# EasyEDA Pro project iPlayer.epro

# Schematic Music player
Board Name: Music player; Create Date: 2026-07-21; Page Name: Sheet_1; Project Name: iPlayer; Schematic Name: Music player; Update Date: 2026-07-21; Add into BOM: yes; Company: Trustmebro; Convert to PCB: yes; Date: 2026-07-12; REV: 1.0; Sheet: 1/1; spicePre: .
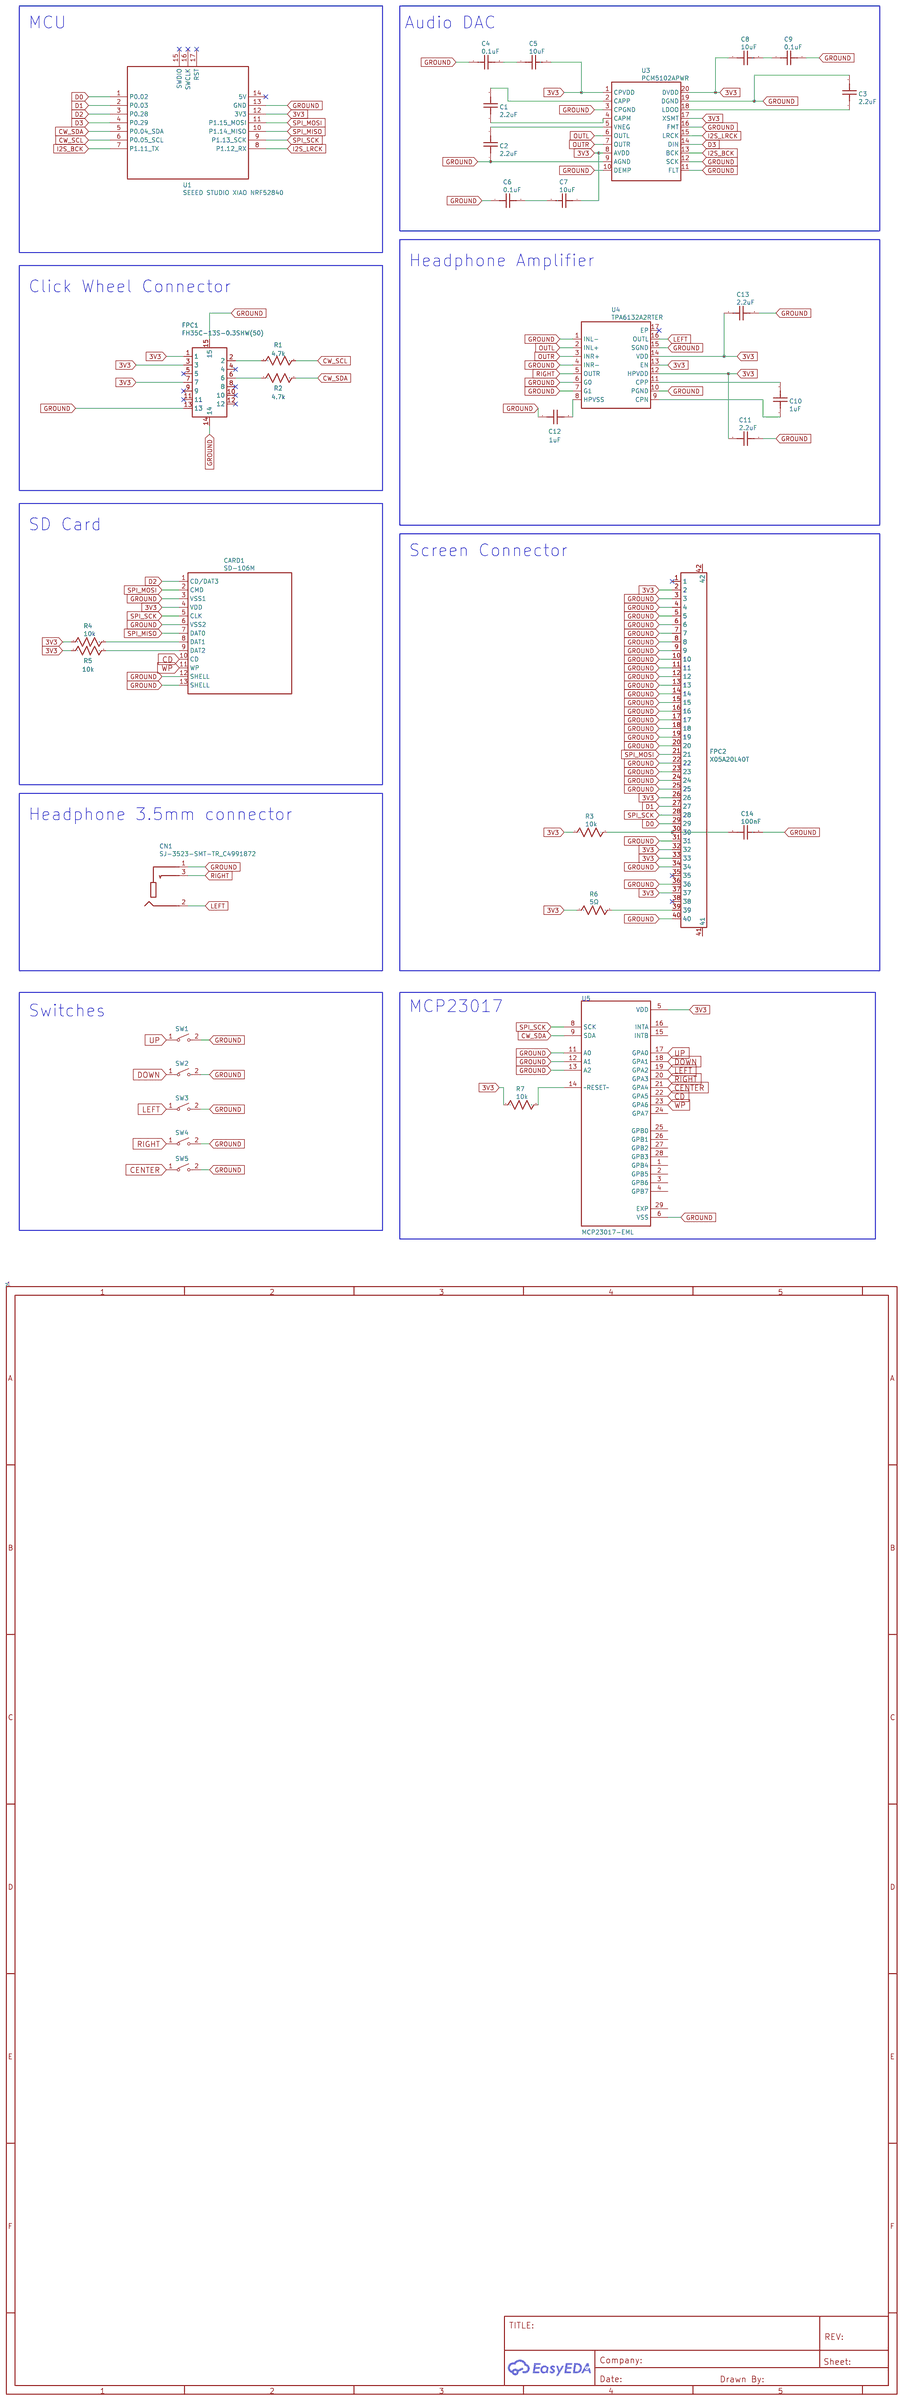
[diagram p0: schematic sheet]

## Parts
C1  2.2uF  [C0603]
C2  2.2uF  [C0603]
C3  2.2uF  [C0603]
C4  0.1uF  [C0603]
C5  10uF  [C0603]
C6  0.1uF  [C0603]
C7  10uF  [C0603]
C8  10uF  [C0603]
C9  0.1uF  [C0603]
C10  1uF  [C0603]
C11  2.2uF  [C0603]
C12  1uF  [C0603]
C13  2.2uF  [C0603]
C14  100nF  [C0603]
CARD1  SD-106M  [SD-SMD_SD-106M]
CN1  SJ-3523-SMT-TR_C4991872  [AUDIO-SMD_SJ-3523-SMT-TR]
FPC1  FH35C-13S-0.3SHW(50)  [FPC-SMD_13P-P0.60_HRS_FH35C-13S-0.3SHW]
FPC2  X05A20L40T  [FFC-SMD_40P-P0.50_X05A20L40T]
R1  4.7k  [R0603]
R2  4.7k  [R0603]
R3  10k  [R0603]
R4  10k  [R0603]
R5  10k  [R0603]
R6  5Ω  [R0603]
R7  10k  [R0603]
SW1  -  [SW-SMD_L3.9-W3.0-P4.45]
SW2  -  [SW-SMD_L3.9-W3.0-P4.45]
SW3  -  [SW-SMD_L3.9-W3.0-P4.45]
SW4  -  [SW-SMD_L3.9-W3.0-P4.45]
SW5  -  [SW-SMD_L3.9-W3.0-P4.45]
U1  SEEED STUDIO XIAO NRF52840  [SEEED STUDIO XIAO NRF52840]
U3  PCM5102APWR  [TSSOP-20_L6.5-W4.4-P0.65-LS6.4-BL]
U4  TPA6132A2RTER  [WQFN-16_L3.0-W3.0-P0.50-TL-EP1.6]
U5  MCP23017-EML  [QFN65P600X600X100-29N]

## Library data of the parts
C1-C3 C11 C13 = 2.2uF: nameAlias: Value(F); Contributor: LCEDA_Lib; spicePre: C; spiceSymbolName: C_0603_US
C4 C6 C9 = 0.1uF: nameAlias: Value(F); Contributor: LCEDA_Lib; spicePre: C; spiceSymbolName: C_0603_US
C5 C7 C8 = 10uF: nameAlias: Value(F); Contributor: LCEDA_Lib; spicePre: C; spiceSymbolName: C_0603_US
C10 C12 = 1uF: nameAlias: Value(F); Contributor: LCEDA_Lib; spicePre: C; spiceSymbolName: C_0603_US
C14 = 100nF: nameAlias: Value(F); Contributor: LCEDA_Lib; spicePre: C; spiceSymbolName: C_0603_US
CARD1 = SD-106M: Supplier: LCSC; Supplier Part: C266603; Manufacturer: XUNPU(讯普); JLCPCB Part Class: Extended Part; Contributor: LCSC; spicePre: C
CN1 = SJ-3523-SMT-TR_C4991872: Supplier: LCSC; Supplier Part: C4991872; Manufacturer: CUI; Manufacturer Part: SJ-3523-SMT-TR; JLCPCB Part Class: Extended Part; Contributor: lcsc; spicePre: C
FPC1 = FH35C-13S-0.3SHW(50): Supplier: LCSC; Supplier Part: C2889266; Manufacturer: HRS(广濑); JLCPCB Part Class: Extended Part; Contributor: LCSC; spicePre: F
FPC2 = X05A20L40T: Supplier: LCSC; Supplier Part: C388677; Manufacturer: XKB Connection(中国星坤); JLCPCB Part Class: Extended Part; Contributor: LCSC; spicePre: F
R1 R2 = 4.7k: nameAlias: Value(Ω); Contributor: LCEDA_Lib; spicePre: R; spiceSymbolName: R_0603_US
R3-R5 R7 = 10k: nameAlias: Value(Ω); Contributor: LCEDA_Lib; spicePre: R; spiceSymbolName: R_0603_US
R6 = 5Ω: nameAlias: Value(Ω); Contributor: LCEDA_Lib; spicePre: R; spiceSymbolName: R_0603_US
SW1-SW5 = TS-1088R-02026: Contact Current:50mA Voltage Rating (DC):12V Circuit:SPST Mounting Style:Brick nogging Actuator Style:Round Button With Lamp:- Switch Length:3.9mm Switch Width:2.93mm Switch Height:2mm; LCSC Part Name: 贴片无柱小龟轻触开关 260GF; Supplier Part: C455280; Manufacturer: XUNPU(讯普); Supplier Footprint: SMD,3x4x2mm; JLCPCB Part Class: Extended Part; Datasheet: https://atta.szlcsc.com/upload/public/pdf/source/20191118/C455280_718CC4284DAF75EEB0AC8229AE7E40C5.pdf; Supplier: LCSC; Contact Current: 50mA; Voltage Rating (DC): 12V; Circuit: SPST; Mounting Style: Brick nogging; Actuator Style: Round Button; Switch Length: 3.9mm; Switch Width: 2.93mm; Switch Height: 2mm
U1 = SEEED STUDIO XIAO NRF52840: Contributor: hafeneger; spicePre: U
U3 = PCM5102APWR: Supplier: LCSC; Manufacturer: TI(德州仪器); Supplier Part: C107671; JLCPCB Part Class: Extended Part; Contributor: LCSC; spicePre: U
U4 = TPA6132A2RTER: Supplier: LCSC; Manufacturer: TI(德州仪器); Supplier Part: C69901; JLCPCB Part Class: Extended Part; spicePre: U
U5 = MCP23017-EML

## Nets
3V3: C5.2 C7.1 C8.1 C11.2 C13.1 CARD1.4(VDD) FPC1.1 FPC1.3 FPC1.7 FPC2.2 FPC2.26 FPC2.32 FPC2.33 FPC2.37 R3.1 R4.1 R5.1 R6.1 R7.1 U1.12(3V3) U3.1(CPVDD) U3.8(AVDD) U3.17(XSMT) U3.20(DVDD) U4.12(HPVDD) U4.13(EN) U4.14(VDD) U5.5(VDD)
CD: CARD1.10(CD) U5.22(GPA5)
CENTER: SW5.1 U5.21(GPA4)
CW_SCL: R1.2 U1.6(P0.05_SCL)
CW_SDA: R2.2 U1.5(P0.04_SDA) U5.9(SDA)
D0: FPC2.29 U1.1(P0.02)
D1: FPC2.27 U1.2(P0.03)
D2: CARD1.1(CD/DAT3) U1.3(P0.28)
D3: U1.4(P0.29) U3.14(DIN)
DOWN: SW2.1 U5.18(GPA1)
GROUND: C2.1 C3.2 C4.1 C6.1 C9.2 C11.1 C12.1 C13.2 C14.2 CARD1.3(VSS1) CARD1.6(VSS2) CARD1.12(SHELL) CARD1.13(SHELL) CN1.1 FPC1.13 FPC1.14 FPC1.15 FPC2.3 FPC2.4 FPC2.5 FPC2.6 FPC2.7 FPC2.8 FPC2.9 FPC2.10 FPC2.11 FPC2.12 FPC2.13 FPC2.14 FPC2.15 FPC2.16 FPC2.17 FPC2.18 FPC2.19 FPC2.20 FPC2.22 FPC2.23 FPC2.24 FPC2.25 FPC2.31 FPC2.34 FPC2.36 FPC2.40 SW1.2 SW2.2 SW3.2 SW4.2 SW5.2 U1.13(GND) U3.3(CPGND) U3.9(AGND) U3.10(DEMP) U3.11(FLT) U3.12(SCK) U3.16(FMT) U3.19(DGND) U4.1(INL-) U4.4(INR-) U4.6(G0) U4.7(G1) U4.10(PGND) U4.15(SGND) U5.6(VSS) U5.11(A0) U5.12(A1) U5.13(A2)
I2S_BCK: U1.7(P1.11_TX) U3.13(BCK)
I2S_LRCK: U1.8(P1.12_RX) U3.15(LRCK)
LEFT: CN1.2 SW3.1 U4.16(OUTL) U5.19(GPA2)
OUTL: U3.6(OUTL) U4.2(INL+)
OUTR: U3.7(OUTR) U4.3(INR+)
RIGHT: CN1.3 SW4.1 U4.5(OUTR) U5.20(GPA3)
SPI_MISO: CARD1.7(DAT0) U1.10(P1.14_MISO)
SPI_MOSI: CARD1.2(CMD) FPC2.21 U1.11(P1.15_MOSI)
SPI_SCK: CARD1.5(CLK) FPC2.28 U1.9(P1.13_SCK) U5.8(SCK)
UP: SW1.1 U5.17(GPA0)
WP: CARD1.11(WP) U5.23(GPA6)
$1N15: FPC1.2 R1.1
$1N17: FPC1.6 R2.1
$1N59: C2.2 U3.5(VNEG)
$1N60: C4.2 C5.1
$1N62: C6.2 C7.2
$1N64: C10.1 U4.9(CPN)
$1N65: C12.2 U4.8(HPVSS)
$1N68: C3.1 U3.18(LDOO)
$1N69: C1.2 U3.2(CAPP)
$1N70: C1.1 U3.4(CAPM)
$1N74: C8.2 C9.1
$1N76: C10.2 U4.11(CPP)
$1N80: CARD1.8(DAT1) R4.2
$1N82: CARD1.9(DAT2) R5.2
$1N114: C14.1 FPC2.30 R3.2
$1N122: FPC2.39 R6.2
$1N2479: R7.2 U5.14(~RESET~)

Not connected (* = marked no-connect by the designer): FPC1 4* 5* 8* 9* 10* 11* 12*; FPC2 1* 35* 38* 41 42; U1 14(5V)* 15(SWDIO)* 16(SWCLK)* 17(RST)*; U4 17(EP)*; U5 1(GPB4) 2(GPB5) 3(GPB6) 4(GPB7) 15(INTB) 16(INTA) 24(GPA7) 25(GPB0) 26(GPB1) 27(GPB2) 28(GPB3) 29(EXP)

## Notes on the sheet
- MCU
- Audio DAC
- Headphone Amplifier
- Click Wheel Connector
- SD Card
- Screen Connector
- Headphone 3.5mm connector
- Switches
- MCP23017

# Board PCB_PCB_Music-player_2026-07-21
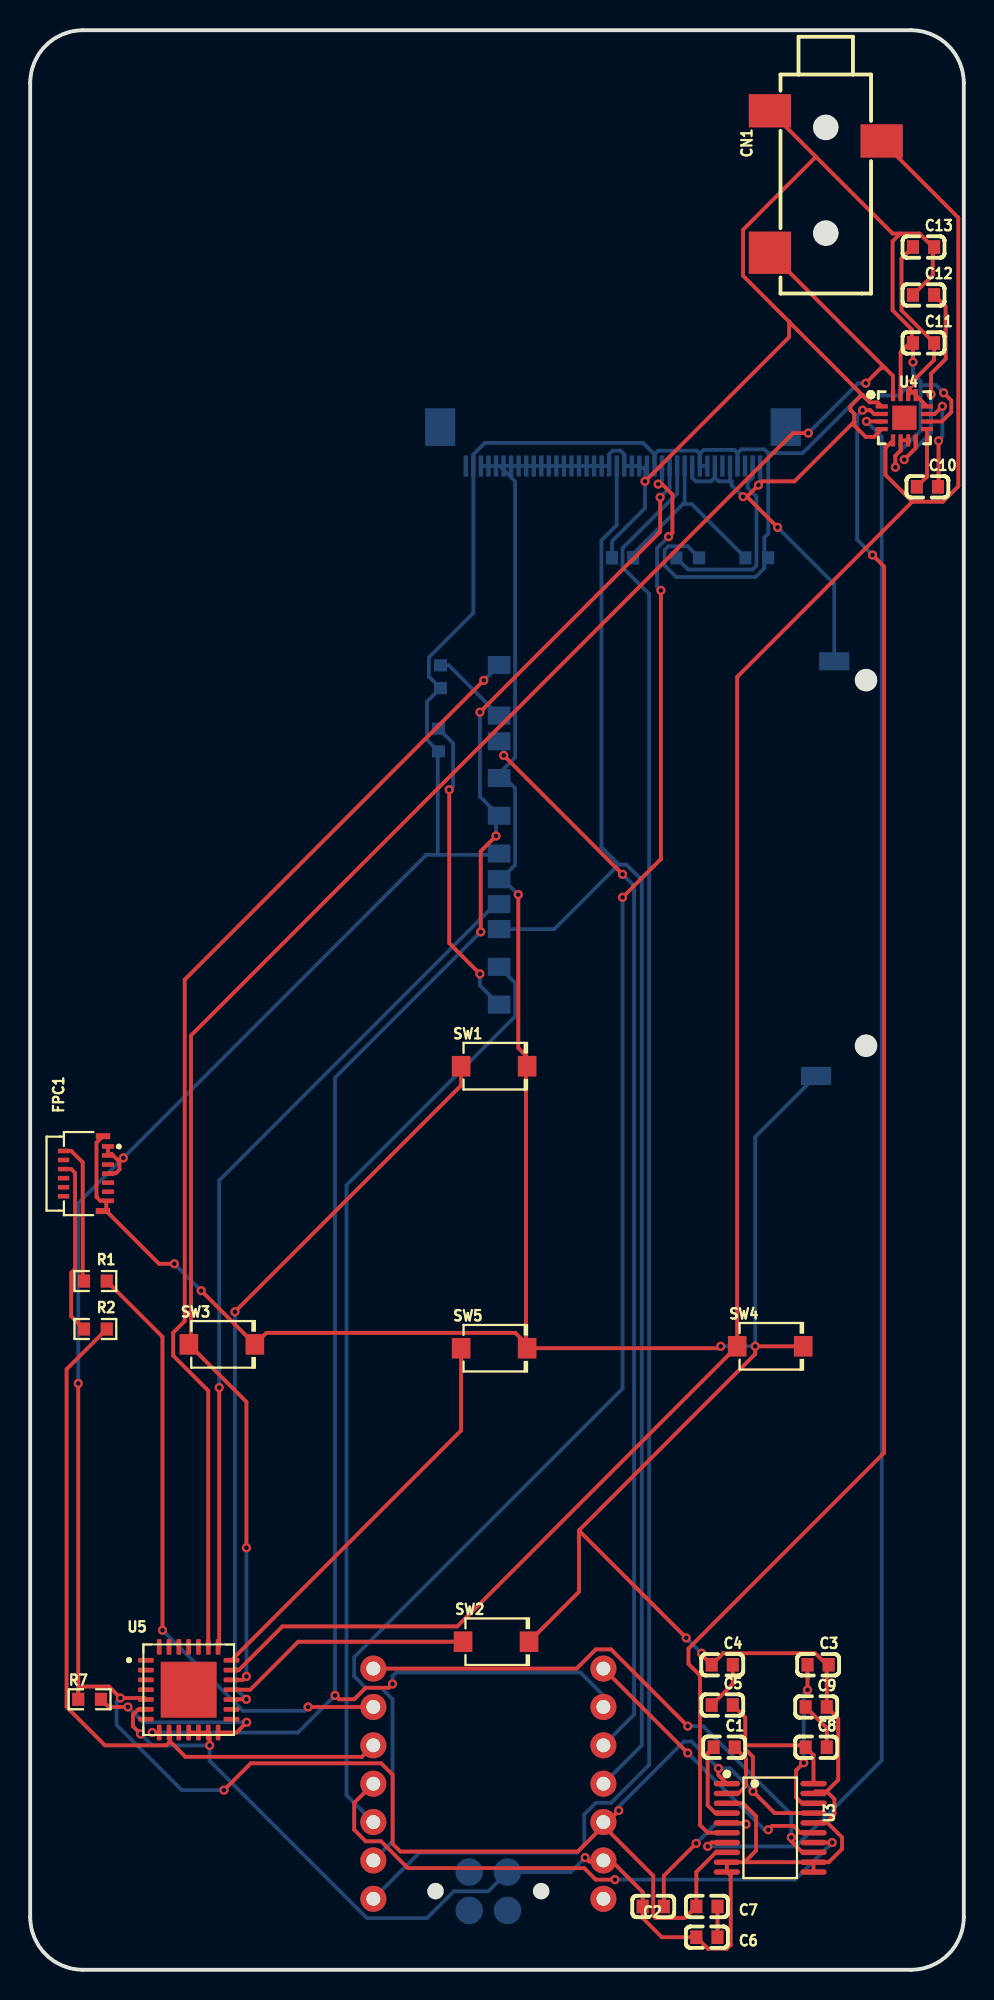
[diagram p1: board, top side]
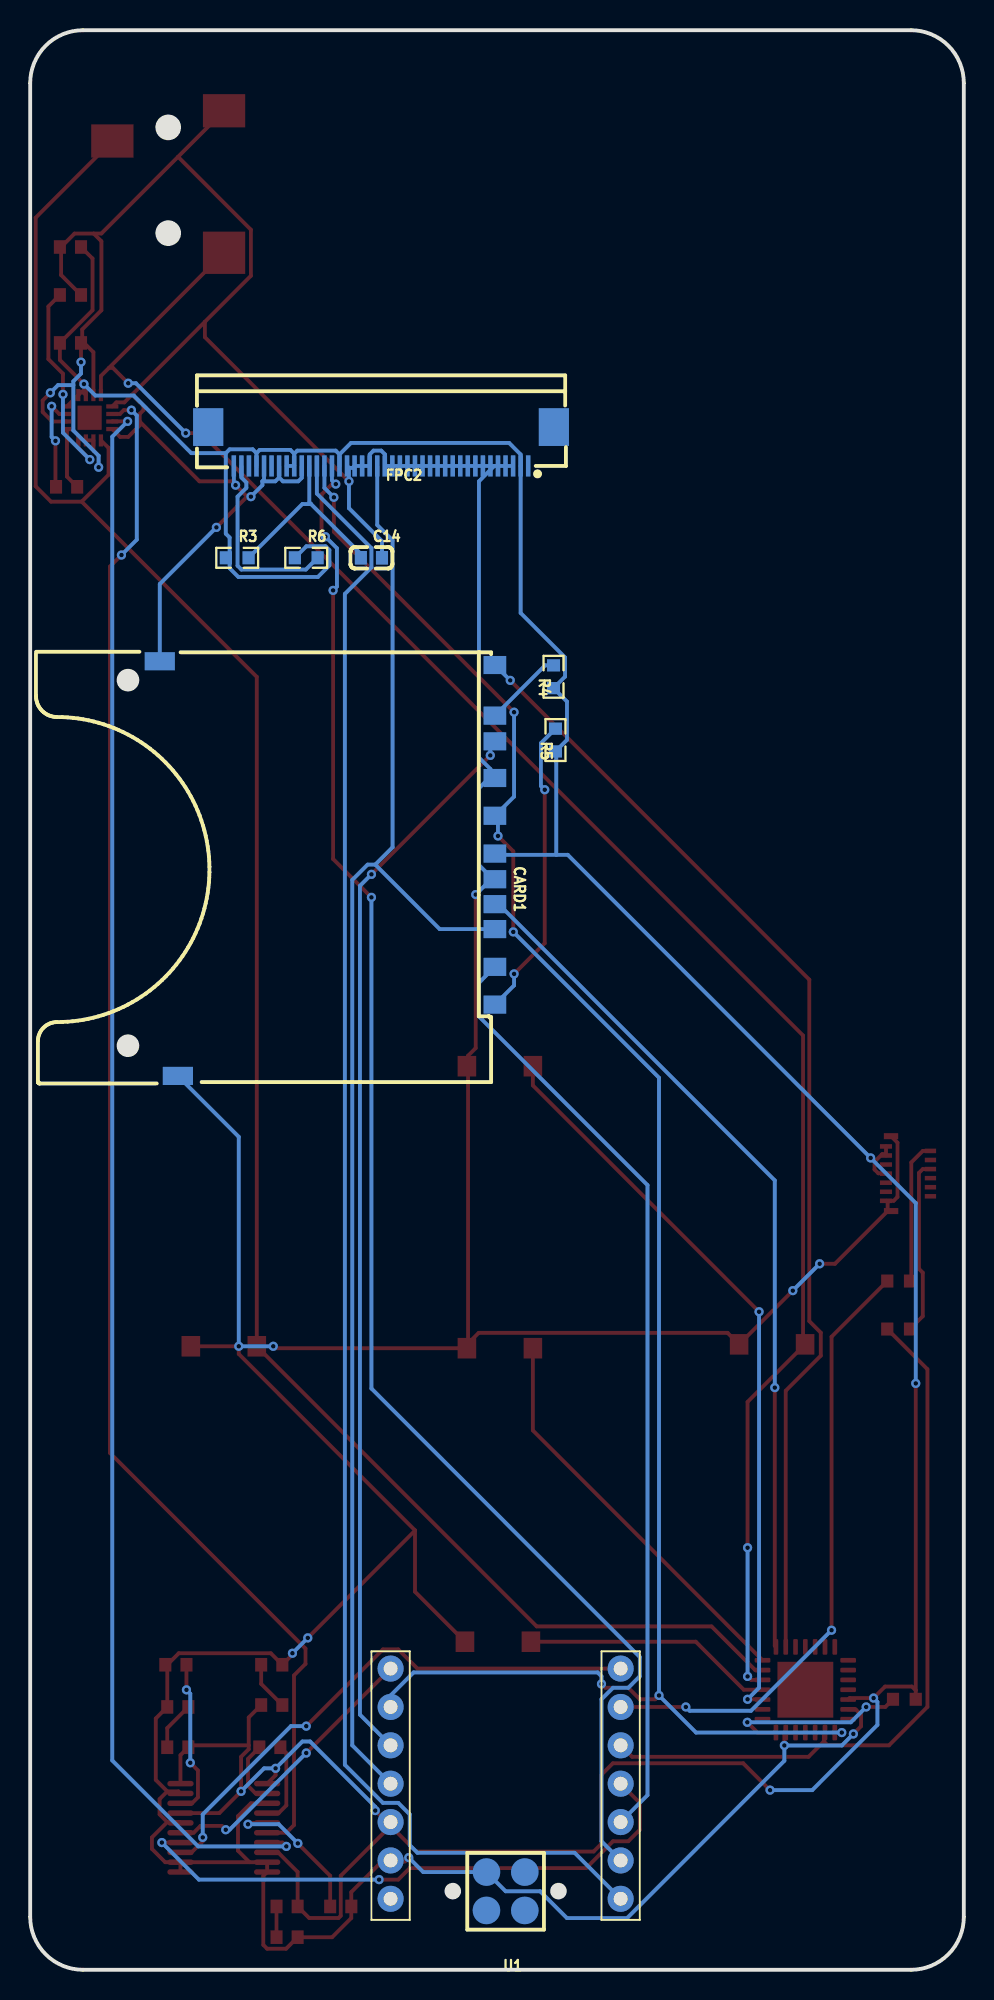
[diagram p2: board, bottom side, seen from below]

Outline 61.85 x 128.4 mm; copper layers: Top Layer, Bottom Layer. Coordinates in mm from the lower left corner of the outline.
Outline path: 0,124.9 0,3.5 arc(1.03,1.03) 3.5,0 58.35,0 arc(60.82,1.03) 61.85,3.5 61.85,124.9 arc(60.82,127.37) 58.35,128.4 3.5,128.4 arc(1.03,127.37) 0,124.9
Stack: Top Layer 0.012mm / Dielectric1 0.025mm FR4 er 4.5 / Bottom Layer 0.012mm

## Design rules (mm)
spacing Default (default): track to track 0.152, other pairs 0 to 0.152
track width Default (default): min 0.254, default 0.254, max 25.4
differential pair differentialPair (default): width min 0.127, default 0.254, max 2.54; gap min 0.152, default 0.152
via Default (default): diameter min 0.61, default 0.61, max 100.025; hole min 0.305, default 0.305, max 59.995

## Placement (name value [footprint] x y rotation side)
C1  2.2uF  [C0603]  45.97 14.73 0 top
C2  2.2uF  [C0603]  41.27 4.19 0 top
C3  2.2uF  [C0603]  52.2 20.19 0 top
C4  0.1uF  [C0603]  45.85 20.19 0 top
C5  10uF  [C0603]  45.85 17.53 0 top
C6  0.1uF  [C0603]  44.83 2.16 0 top
C7  10uF  [C0603]  44.83 4.19 0 top
C8  10uF  [C0603]  52.07 14.73 0 top
C9  0.1uF  [C0603]  52.07 17.4 0 top
C10  1uF  [C0603]  59.44 98.17 0 top
C11  2.2uF  [C0603]  59.18 107.7 0 top
C12  1uF  [C0603]  59.18 110.87 0 top
C13  2.2uF  [C0603]  59.18 114.05 0 top
C14  100nF  [C0603]  39.24 93.47 180 bottom
CARD1  SD-106M  [SD-SMD_SD-106M]  42.16 72.9 270 bottom
CN1  SJ-3523-SMT-TR_C4991872  [AUDIO-SMD_SJ-3523-SMT-TR]  52.7 118.36 270 top
FPC1  FH35C-13S-0.3SHW(50)  [FPC-SMD_13P-P0.60_HRS_FH35C-13S-0.3SHW]  3.68 52.7 90 top
FPC2  X05A20L40T  [FFC-SMD_40P-P0.50_X05A20L40T]  38.61 100.84 0 bottom
R1  4.7k  [R0603]  4.32 45.59 0 top
R2  4.7k  [R0603]  4.32 42.42 0 top
R3  10k  [R0603]  48.13 93.47 180 bottom
R4  10k  [R0603]  27.18 85.6 90 bottom
R5  10k  [R0603]  27.05 81.41 90 bottom
R6  5Ω  [R0603]  43.56 93.47 180 bottom
R7  10k  [R0603]  3.94 17.91 0 top
SW1  -  [SW-SMD_L3.9-W3.0-P4.45]  30.73 59.82 0 top
SW2  -  [SW-SMD_L3.9-W3.0-P4.45]  30.86 21.72 0 top
SW3  -  [SW-SMD_L3.9-W3.0-P4.45]  12.7 41.4 0 top
SW4  -  [SW-SMD_L3.9-W3.0-P4.45]  49.02 41.27 0 top
SW5  -  [SW-SMD_L3.9-W3.0-P4.45]  30.73 41.15 0 top
U1  -  [SEEED STUDIO XIAO NRF52840]  30.35 12.32 0 bottom
U3  PCM5102APWR  [TSSOP-20_L6.5-W4.4-P0.65-LS6.4-BL]  49.02 9.4 270 top
U4  TPA6132A2RTER  [WQFN-16_L3.0-W3.0-P0.50-TL-EP1.6]  57.91 102.74 0 top
U5  MCP23017-EML  [QFN65P600X600X100-29N]  10.5 18.54 0 top

## Footprints (pads in the part's own frame, mm; a bottom-side part is the same pattern mirrored in y, then rotated)
AUDIO-SMD_SJ-3523-SMT-TR
  rect 2.2x2.8 smd: 1(-4.7,-3.7) 3(-2.7,3.7)
  rect 2.8x2.8 smd: 2(4.7,-3.7)
C0603
  rect 0.8x0.9 smd: 1(-0.7,0) 2(0.7,0)
FFC-SMD_40P-P0.50_X05A20L40T
  rect 0.3x1.4 smd: 1(-9.75,1.288) 2(-9.25,1.288) 3(-8.75,1.288) 4(-8.25,1.288) 5(-7.75,1.288) 6(-7.25,1.288) 7(-6.75,1.288) 8(-6.25,1.288) 9(-5.75,1.288) 10(-5.25,1.288) 11(-4.75,1.288) 12(-4.25,1.288) 13(-3.75,1.288) 14(-3.25,1.288) 15(-2.75,1.288) 16(-2.25,1.288) 17(-1.75,1.288) 18(-1.25,1.288) 19(-0.75,1.288) 20(-0.25,1.288) 21(0.25,1.288) 22(0.75,1.288) 23(1.25,1.288) 24(1.75,1.288) 25(2.25,1.288) 26(2.75,1.288) 27(3.25,1.288) 28(3.75,1.288) 29(4.25,1.288) 30(4.75,1.288) 31(5.25,1.288) 32(5.75,1.288) 33(6.25,1.288) 34(6.75,1.288) 35(7.25,1.288) 36(7.75,1.288) 37(8.25,1.288) 38(8.75,1.288) 39(9.25,1.288) 40(9.75,1.288)
  rect 2x2.5 smd: 41(11.45,-1.288) 42(-11.45,-1.288)
FPC-SMD_13P-P0.60_HRS_FH35C-13S-0.3SHW
  rect 0.3x0.8 smd: 1(1.8,-1.472) 3(1.2,-1.472) 5(0.6,-1.473) 7(0,-1.472) 9(-0.6,-1.472) 11(-1.2,-1.472) 13(-1.8,-1.472)
  rect 0.3x0.75 smd: 2(1.5,1.473) 4(0.902,1.472) 6(0.3,1.473) 8(-0.3,1.473) 10(-0.9,1.473) 12(-1.5,1.473)
  rect 0.4x0.95 smd: 14(-2.478,-1.133) 15(2.478,-1.139)
QFN65P600X600X100-29N
  rrect 1.04x0.31 smd: 1(-2.835,1.95) 2(-2.835,1.3) 3(-2.835,0.65) 4(-2.835,0) 5(-2.835,-0.65) 6(-2.835,-1.3) 7(-2.835,-1.95) 15(2.835,-1.95) 16(2.835,-1.3) 17(2.835,-0.65) 18(2.835,0) 19(2.835,0.65) 20(2.835,1.3) 21(2.835,1.95)
  rrect 0.31x1.04 smd: 8(-1.95,-2.835) 9(-1.3,-2.835) 10(-0.65,-2.835) 11(0,-2.835) 12(0.65,-2.835) 13(1.3,-2.835) 14(1.95,-2.835) 22(1.95,2.835) 23(1.3,2.835) 24(0.65,2.835) 25(0,2.835) 26(-0.65,2.835) 27(-1.3,2.835) 28(-1.95,2.835)
  rect 3.7x3.7 smd: 29(0,0)
R0603
  rect 0.806x0.864 smd: 1(-0.753,0) 2(0.753,0)
SD-SMD_SD-106M
  rect 1.2x1.5 smd: 1(6.505,11.1) 2(4.005,11.1) 3(0.705,11.1) 4(-0.995,11.1) 5(-3.495,11.1) 6(-5.995,11.1) 7(-8.425,11.1) 8(-10.125,11.1) 9(9.005,11.1) 10(2.355,11.1) 11(-13.475,11.1)
  rect 1.2x2 smd: 12(-13.725,-11.1) 13(13.725,-9.9)
SEEED STUDIO XIAO NRF52840
  round 1.728 hole 0.914: 1(-7.62,7.62) 2(-7.62,5.08) 3(-7.62,2.54) 4(-7.62,0) 5(-7.62,-2.54) 6(-7.62,-5.08) 7(-7.62,-7.62) 8(7.62,-7.62) 9(7.62,-5.08) 10(7.62,-2.54) 11(7.62,0) 12(7.62,2.54) 13(7.62,5.08) 14(7.62,7.62)
  round 1.829 smd: 13(1.27,5.85) 15(-1.27,8.39) 16(1.27,8.39) 17(-1.27,5.85)
SW-SMD_L3.9-W3.0-P4.45
  rect 1.23x1.36 smd: 1(-2.185,0) 2(2.185,0)
TSSOP-20_L6.5-W4.4-P0.65-LS6.4-BL
  oval 0.364x1.742 smd: 1(-2.925,-2.871) 2(-2.275,-2.871) 3(-1.625,-2.871) 4(-0.975,-2.871) 5(-0.325,-2.871) 6(0.325,-2.871) 7(0.975,-2.871) 8(1.625,-2.871) 9(2.275,-2.871) 10(2.925,-2.871) 11(2.925,2.871) 12(2.275,2.871) 13(1.625,2.871) 14(0.975,2.871) 15(0.325,2.871) 16(-0.325,2.871) 17(-0.975,2.871) 18(-1.625,2.871) 19(-2.275,2.871) 20(-2.925,2.871)
WQFN-16_L3.0-W3.0-P0.50-TL-EP1.6
  rect 0.8x0.28 smd: 1(-1.5,0.749) 2(-1.5,0.249) 3(-1.5,-0.249) 4(-1.5,-0.75) 9(1.5,-0.75) 10(1.5,-0.249) 11(1.5,0.249) 12(1.5,0.749)
  rect 0.28x0.8 smd: 5(-0.749,-1.5) 6(-0.249,-1.5) 7(0.249,-1.5) 8(0.75,-1.5) 13(0.75,1.5) 14(0.249,1.5) 15(-0.249,1.5) 16(-0.749,1.5)
  rect 1.6x1.6 smd: 17(0,0)

## Nets
As in the schematic.

Pads without a net: FPC1 4 5 8 9 10 11 12; FPC2 1 35 38 41 42; U1 14 15 16 17; U4 17; U5 1 2 3 4 7 10 15 16 24 25 26 27 28 29

## Via types
v1: diameter 0.61, hole 0.305, Top Layer to Bottom Layer, 70 vias

## Routing (per net, layer and track width the routed paths; a pad name or vN(x,y) marks a point on that pad's centre or on a via; arc(x,y) is an arc through that point)
3V3: length 265
  Top Layer w0.254: U3.1 45.59,12.88 v1(45.59,13.34) ; v1(12.84,11.89) 14.61,13.67 23.25,13.67 24.01,12.91 24.01,8.34 24.52,7.83 36.28,7.83 37.97,9.53 ; 37.97,9.53 41.27,6.22 41.27,3.57 41.42,3.43 43.37,3.43 C7.1 44.13,6.48 45.4,7.75 46.12,7.75 U3.8 ; 37.97,9.53 U1.12 38.23,9.78 v1(38.99,10.54) ; 5.92,53.49 v1(6.17,53.74) ; 5.92,53.49 5.92,52.98 5.66,52.73 5.18,52.73 FPC1.7 ; 5.92,53.49 5.41,54 5.16,54 ; 58.29,104.46 58.44,104.46 U4.13 U4.12 ; 58.29,104.46 58.29,104.37 U4.14 ; 58.29,104.46 v1(58.29,104.97) 59.88,106.57 C11.2 57.72,109.86 57.72,113.28 C13.1 ; v1(3.18,38.82) 3.18,18.5 ; 3.18,18.5 3.44,18.75 5.22,18.75 v1(5.98,17.99) 7.56,17.99 U5.5 ; 3.18,18.5 R7.1 ; 47.37,14.86 47.37,16.7 C5.2 ; 47.37,14.86 51.24,14.86 C8.1 51.89,14.21 U3.20 ; 47.37,14.86 47.37,14.6 47.88,14.1 v1(47.88,11.81) 49.32,10.37 U3.17 ; 5.16,54 FPC1.3 ; 5.16,54 FPC1.1
  Bottom Layer w0.254: 48.64,93.54 48.64,94.81 48.89,95.07 48.89,100.4 ; 48.64,93.54 48.64,92.78 48.06,92.2 42.79,92.2 42.03,92.96 42.03,93.98 42.28,94.23 43.55,94.23 R6.1 ; 48.64,93.54 48.82,93.54 R3.1 ; v1(12.84,11.89) 10.04,11.89 5.72,16.21 5.72,17.73 v1(5.98,17.99) ; 46.86,100.4 FPC2.37 ; 46.86,100.4 47.11,100.65 48.64,100.65 48.89,100.4 ; 46.86,100.4 46.64,100.61 44.61,100.61 44.36,100.36 ; v1(38.99,10.54) 38.99,10.79 43.31,15.11 43.82,15.11 v1(45.59,13.34) 46.36,13.34 v1(47.88,11.81) ; FPC2.33 FPC2.32 44.36,100.36 ; 41.36,100.31 41.61,100.57 44.15,100.57 44.36,100.36 ; 41.36,100.31 40.6,101.07 30.12,101.07 29.36,100.31 FPC2.2 29.36,89.82 26.42,86.88 26.42,85.61 R4.1 26.29,83.96 26.29,81.42 R5.1 27,80.6 27,73.81 ; 41.36,100.31 FPC2.26 ; 48.89,100.4 51.18,100.4 54.99,104.21 57.53,104.21 v1(58.29,104.97) ; 27,73.81 30.98,73.81 CARD1.4 ; 27,73.81 26.24,73.81 v1(6.17,53.74) 3.18,50.75 v1(3.18,38.82)
CD: length 57
  Top Layer w0.254: U5.22 12.52,21.45 v1(12.52,38.54)
  Bottom Layer w0.254: CARD1.10 30.81,70.54 12.52,52.25 v1(12.52,38.54)
CENTER: length 27
  Top Layer w0.254: SW5.1 28.55,35.71 U5.21
CW_SCL: length 40.9
  Top Layer w0.254: U1.6 v1(18.42,17.4) ; R1.2 8.76,41.9 v1(8.76,22.48)
  Bottom Layer w0.254: v1(18.42,17.4) 18.16,17.15 14.1,17.15 v1(8.76,22.48)
CW_SDA: length 49
  Top Layer w0.254: 9.27,15.11 9.27,15.63 U5.9 ; 9.27,15.11 9.02,14.86 4.95,14.86 2.41,17.4 2.41,39.76 R2.2 ; 9.27,15.11 10.29,14.1 21.97,14.1 U1.5
D0: length 111.3
  Bottom Layer w0.254: U1.1 25.78,7.75 36.2,7.75 36.7,8.25 36.7,10.29 37.46,11.05 38.48,11.05 41,13.57 41,91.08 39.24,92.84 39.24,94.11 42.86,97.72 FPC2.29
D1: length 104.1
  Top Layer w0.254: v1(42.29,94.87) 42.55,95.12 42.55,97.66 41.86,98.35 v1(41.6,98.35) ; v1(39.24,70.99) 41.78,73.53 v1(41.78,91.31)
  Bottom Layer w0.254: FPC2.27 41.86,98.6 v1(41.6,98.35) ; v1(42.29,94.87) 41.53,94.11 41.53,91.57 v1(41.78,91.31) ; U1.2 24,8.51 24,17.91 23.24,18.67 22.23,18.67 21.46,19.43 21.46,20.7 39.24,38.48 v1(39.24,70.99)
D2: length 62.4
  Bottom Layer w0.254: U1.3 20.95,11.56 20.95,51.94 32.13,63.12 32.13,65.33 CARD1.1
D3: length 38.9
  Top Layer w0.254: v1(38.73,5.97) 37.46,5.97 36.7,6.73 25.02,6.73 23.24,8.51 22.23,8.51 21.46,9.27 21.46,11.05 U1.4 ; v1(53.13,8.42) U3.14
  Bottom Layer w0.254: v1(53.13,8.42) 50.67,5.97 v1(38.73,5.97)
DOWN: length 16.7
  Top Layer w0.254: U5.18 14.58,18.54 17.75,21.72 SW2.1
GROUND: length 413.4
  Top Layer w0.254: 44.14,2.16 44.9,1.39 46.15,1.39 46.4,1.65 46.4,6.22 U3.10 U3.9 47.32,7.12 ; 44.14,2.16 41.85,2.16 40.58,3.42 40.58,4.19 ; 44.14,2.16 C6.1 ; 47.32,7.12 48.08,7.88 48.08,10.17 47.23,11.02 U3.3 ; 47.32,7.12 U3.12 ; U4.10 60.39,102.49 61.02,103.12 61.02,103.89 v1(60.51,104.39) ; U3.12 52.9,7.12 53.78,8 53.78,8.76 52.77,9.78 ; U3.12 U3.11 ; 32.84,41.46 32.14,42.16 15.65,42.16 SW3.2 v1(11.33,44.96) ; 32.84,41.46 32.84,59.75 ; 32.84,41.46 SW5.2 45.62,41.15 v1(45.75,41.27) ; FPC1.15 4.39,54.76 4.39,51.16 4.65,50.91 FPC1.13 5.04,50.79 5.04,50.23 ; v1(57.32,99.47) 57.32,100.23 57.66,100.58 U4.6 U4.7 ; 52.77,20.19 C3.2 ; 52.77,20.19 52.01,20.95 45.91,20.95 C4.1 44.48,20.86 v1(44.48,20.95) ; 52.77,20.19 52.77,17.4 ; U4.1 56.14,103.76 55.61,103.76 55.1,104.27 ; U3.16 51.95,9.78 52.77,9.78 ; 54.59,102.49 54.59,103 54.34,103.25 54.34,103.51 55.1,104.27 ; 54.59,102.49 50.64,98.53 48.5,98.53 v1(48.24,98.28) 47.48,97.52 ; 54.59,102.49 54.59,102.24 55.36,101.47 55.89,101.47 U4.4 ; 55.1,104.27 50.27,109.09 ; U4.15 57.66,107.08 58.4,107.82 ; 5.04,50.23 8.54,46.74 v1(9.55,46.74) ; 5.04,50.23 FPC1.14 ; 32.84,59.75 SW1.2 ; 32.84,59.75 32.84,60.51 32.33,61.02 v1(32.33,71.18) ; 38.04,7.17 38.55,7.17 40.58,5.14 40.58,4.19 ; 38.04,7.17 U1.13 ; 38.04,7.17 37.02,7.17 v1(36.77,7.43) ; 40.58,4.19 C2.1 ; v1(11.89,14.85) 11.89,15.61 U5.13 U5.12 U5.11 ; 47.48,97.52 v1(47.23,97.52) ; 47.48,97.52 v1(49.51,95.49) ; 58.4,107.82 C11.1 v1(58.48,106.43) ; 58.4,107.82 58.4,108.59 57.13,109.86 57.13,114.43 57.64,114.94 ; v1(40.73,98.53) 50.27,108.08 50.27,109.09 ; C12.1 59.8,112.19 59.8,114.05 ; 50.27,109.09 47.23,112.14 47.23,115.19 52.05,120.02 ; 52.77,11.81 53.53,12.57 53.53,16.64 52.77,17.4 ; 52.77,11.81 53.27,11.3 53.27,10.29 52.77,9.78 ; 52.77,11.81 52.03,11.81 U3.19 ; 36.36,29.07 36.36,29.09 48.03,40.77 v1(48.03,41.27) SW4.2 ; 36.36,29.07 v1(43.46,21.97) ; 36.36,29.07 36.36,25.03 SW2.2 ; 36.36,29.07 36.35,29.08 ; U5.6 7.16,17.24 6.81,16.88 6.81,16.12 v1(7.32,15.61) ; 59.8,114.05 58.91,114.94 57.64,114.94 ; 59.8,114.05 C13.2 ; 52.05,120.02 57.13,114.94 57.64,114.94 ; 52.05,120.02 CN1.1
  Bottom Layer w0.254: v1(11.33,44.96) v1(9.55,46.74) ; 58.99,104.9 58.99,105.16 58.48,105.66 v1(58.48,106.43) ; 58.99,104.9 58.99,101.9 57.32,100.23 v1(57.32,99.47) ; 58.99,104.9 60.01,104.9 v1(60.51,104.39) ; 40.73,99.42 v1(40.73,98.53) 40.73,96.76 38.54,94.57 C14.2 ; 40.73,99.42 FPC2.25 ; 40.73,99.42 40.48,99.42 FPC2.24 FPC2.23 FPC2.22 39.36,100.31 39.1,100.57 38.6,100.57 38.34,100.31 38.34,99.57 FPC2.20 FPC2.19 FPC2.18 FPC2.17 FPC2.16 FPC2.15 FPC2.14 FPC2.13 FPC2.12 FPC2.11 FPC2.10 FPC2.9 FPC2.8 FPC2.7 FPC2.6 31.1,99.55 ; FPC2.40 48.36,98.4 v1(48.24,98.28) ; 31.1,99.55 FPC2.5 FPC2.4 FPC2.3 ; 31.1,99.55 32.12,98.53 32.12,80.25 31.36,79.48 31.36,78.98 ; 45.36,98.79 45.61,98.53 46.46,98.53 ; 45.36,98.79 FPC2.34 ; 45.36,98.79 45.1,98.53 44.09,98.53 43.86,98.76 FPC2.31 ; CARD1.13 48.03,55.14 v1(48.03,41.27) v1(45.75,41.27) ; v1(7.32,15.61) 8.08,14.85 v1(11.89,14.85) 11.89,13.84 22.3,3.42 26.29,3.42 28.07,5.2 30.35,5.2 U1.13 35.81,6.47 v1(36.77,7.43) ; CARD1.12 53.26,91.74 v1(49.51,95.49) ; 31.18,72.19 31.32,72.19 v1(32.33,71.18) ; 31.18,72.19 CARD1.3 ; 31.18,72.19 32.12,73.13 32.12,78.21 31.36,78.98 ; 46.46,98.53 46.36,98.64 FPC2.36 ; 46.46,98.53 46.46,98.28 v1(47.23,97.52) ; v1(43.46,21.97) v1(44.48,20.95) ; CARD1.6 31.15,78.98 31.36,78.98
I2S_BCK: length 36.3
  Top Layer w0.254: v1(50.42,8.76) 50.42,8.51 51.18,7.75 51.87,7.75 U3.13 ; U1.7 36.2,19.94 37.46,21.21 38.48,21.21 v1(43.56,16.13)
  Bottom Layer w0.254: v1(43.56,16.13) 44.58,16.13 50.42,10.29 v1(50.42,8.76)
I2S_LRCK: length 18.6
  Top Layer w0.254: U3.15 51.02,9.07 50.57,9.53 49.15,9.53 v1(48.89,9.27) ; U1.8 v1(43.56,14.35)
  Bottom Layer w0.254: v1(43.56,14.35) 48.64,9.27 v1(48.89,9.27)
LEFT: length 122.2
  Top Layer w0.254: U4.16 57.16,105.51 56.62,106.04 ; 56.62,106.04 CN1.2 ; 56.62,106.04 56.37,106.04 v1(55.36,105.03) ; v1(51.55,101.73) 50.53,101.73 10.65,61.85 10.65,41.54 SW3.1 14.33,37.59 v1(14.33,27.94) ; U5.19 14.09,19.19 v1(14.33,19.42)
  Bottom Layer w0.254: v1(51.55,101.73) 54.85,105.03 v1(55.36,105.03) ; v1(14.33,27.94) v1(14.33,19.42)
OUTL: length 103.6
  Top Layer w0.254: U3.6 44.88,9.07 44.37,9.58 44.37,19.49 43.61,20.25 43.61,21.26 56.57,34.22 56.57,92.89 v1(55.8,93.66) ; v1(55.14,103.25) 55.65,103.25 55.9,102.99 U4.2
  Bottom Layer w0.254: v1(55.14,103.25) 54.79,102.89 54.79,94.67 v1(55.8,93.66)
OUTR: length 105.3
  Top Layer w0.254: U3.7 45.14,8.42 v1(44.88,8.17) ; v1(55.4,102.5) 56.4,102.5 U4.3
  Bottom Layer w0.254: v1(55.4,102.5) 56.41,101.49 56.41,13.86 50.72,8.17 v1(44.88,8.17)
RIGHT: length 136.5
  Top Layer w0.254: 58.44,97.19 60.47,97.19 61.48,98.2 61.48,115.98 CN1.3 ; 58.44,97.19 56.66,98.97 56.66,100.75 U4.5 ; 58.44,97.19 46.84,85.59 SW4.1 28.3,22.73 16.71,22.73 13.82,19.84 U5.20
SPI_MISO: length 71
  Top Layer w0.254: v1(39.24,72.52) v1(31.37,80.39)
  Bottom Layer w0.254: v1(39.24,72.52) 40.01,71.75 40.01,16.89 U1.10 ; CARD1.7 31.37,81.02 v1(31.37,80.39)
SPI_MOSI: length 99.8
  Bottom Layer w0.254: U1.11 40.51,14.86 40.51,72.14 39.5,73.16 38.99,73.16 ; FPC2.21 38.86,95.64 37.84,94.63 37.84,74.31 38.99,73.16 ; 38.99,73.16 34.72,68.89 CARD1.2
SPI_SCK: length 125.5
  Top Layer w0.254: v1(8.08,15.7) U5.8 ; v1(30.86,75.06) 29.84,74.04 v1(29.84,68.71) ; v1(29.79,83.25) 41.73,95.19 v1(41.73,97.47) ; v1(24,18.92) 23.75,18.67 22.23,18.67 21.46,17.91 20.45,17.91 v1(20.19,18.16)
  Bottom Layer w0.254: FPC2.28 42.36,98.1 v1(41.73,97.47) ; v1(24,18.92) 24,19.43 24.26,19.69 36.45,19.69 37.97,18.16 U1.9 ; v1(29.84,68.71) 20.19,59.05 v1(20.19,18.16) 17.74,15.7 v1(8.08,15.7) ; v1(29.79,83.25) 29.79,77.66 CARD1.5 30.86,76.19 v1(30.86,75.06)
UP: length 49.4
  Top Layer w0.254: U5.17 13.35,17.91 v1(14.33,17.91) ; SW1.1 28.55,58.55 v1(13.56,43.56)
  Bottom Layer w0.254: v1(14.33,17.91) 13.56,18.67 v1(13.56,43.56)
WP: length 74.9
  Top Layer w0.254: U5.23 11.8,38.33 9.47,40.65 9.47,42.18 10.24,42.94 10.24,65.55 v1(30.05,85.36)
  Bottom Layer w0.254: CARD1.11 v1(30.05,85.36)
$1N15: length 9.5
  Top Layer w0.254: R1.1 3.48,45.68 3.48,53.44 2.72,54.21 FPC1.2
$1N17: length 11.7
  Top Layer w0.254: FPC1.6 2.72,53 2.97,52.75 2.97,46.4 2.72,46.15 2.72,43.26 R2.1
$1N59: length 10.2
  Top Layer w0.254: U3.5 47.33,9.72 v1(47.42,9.64) ; C2.2 41.98,6.22 v1(44.12,8.37)
  Bottom Layer w0.254: v1(47.42,9.64) 45.39,9.64 v1(44.12,8.37)
$1N60: length 3.2
  Top Layer w0.254: C4.2 46.55,18.93 C5.1
$1N62: length 2
  Top Layer w0.254: C6.2 C7.2
$1N64: length 4.1
  Top Layer w0.254: U4.9 59.41,98.85 C10.1
$1N65: length 13.9
  Top Layer w0.254: C12.2 60.64,110.11 60.64,106.63 59.68,105.66 v1(59.68,104.29) ; v1(57.9,99.97) 58.66,100.73 U4.8
  Bottom Layer w0.254: v1(59.68,104.29) 59.68,101.75 v1(57.9,99.97)
$1N68: length 10.4
  Top Layer w0.254: U3.18 51.13,11.02 50.73,11.42 50.73,13.2 v1(51.24,13.7) ; v1(51.5,18.53) C3.1
  Bottom Layer w0.254: v1(51.5,18.53) 51.24,18.28 v1(51.24,13.7)
$1N69: length 4.3
  Top Layer w0.254: C1.2 46.67,14.71 47.42,13.96 47.42,12.18 46.91,11.67 U3.2
$1N70: length 5.5
  Top Layer w0.254: C1.1 44.88,14.34 44.88,10.88 45.39,10.37 U3.4
$1N74: length 3.2
  Top Layer w0.254: C8.2 52.77,16 C9.1
$1N76: length 6.7
  Top Layer w0.254: C10.2 60.17,98.21 v1(60.17,101.21) ; v1(60.43,103.5) 59.92,102.99 U4.11
  Bottom Layer w0.254: v1(60.17,101.21) 60.43,101.47 v1(60.43,103.5)
$1N80: length 5.3
  Bottom Layer w0.254: CARD1.8 27.74,86.35 R4.2
$1N82: length 20.1
  Top Layer w0.254: v1(27.76,78.12) 27.76,67.96 v1(29.79,65.92)
  Bottom Layer w0.254: R5.2 28.02,81.2 28.02,78.37 v1(27.76,78.12) ; CARD1.9 29.79,65.16 v1(29.79,65.92)
$1N114: length 13.1
  Bottom Layer w0.254: 43.24,97.03 43.36,97.14 FPC2.30 ; 43.24,97.03 39.94,93.73 C14.1 ; 43.24,97.03 43.82,97.03 R3.2
$1N122: length 12.7
  Bottom Layer w0.254: FPC2.39 47.86,98.79 47.53,98.46 47.53,98.1 48.11,97.52 48.11,92.95 47.86,92.69 43.59,92.69 R6.2
$1N2479: length 12.5
  Top Layer w0.254: v1(14.34,16.38) 13.66,15.7 U5.14 ; v1(6.47,17.4) 5.2,17.4 R7.2
  Bottom Layer w0.254: v1(14.34,16.38) 7.48,16.38 v1(6.47,17.4)
